# Altium schematic sheet CONNECTORS.SchDoc
size A3; SheetNumber: 4; SheetTotal: 7
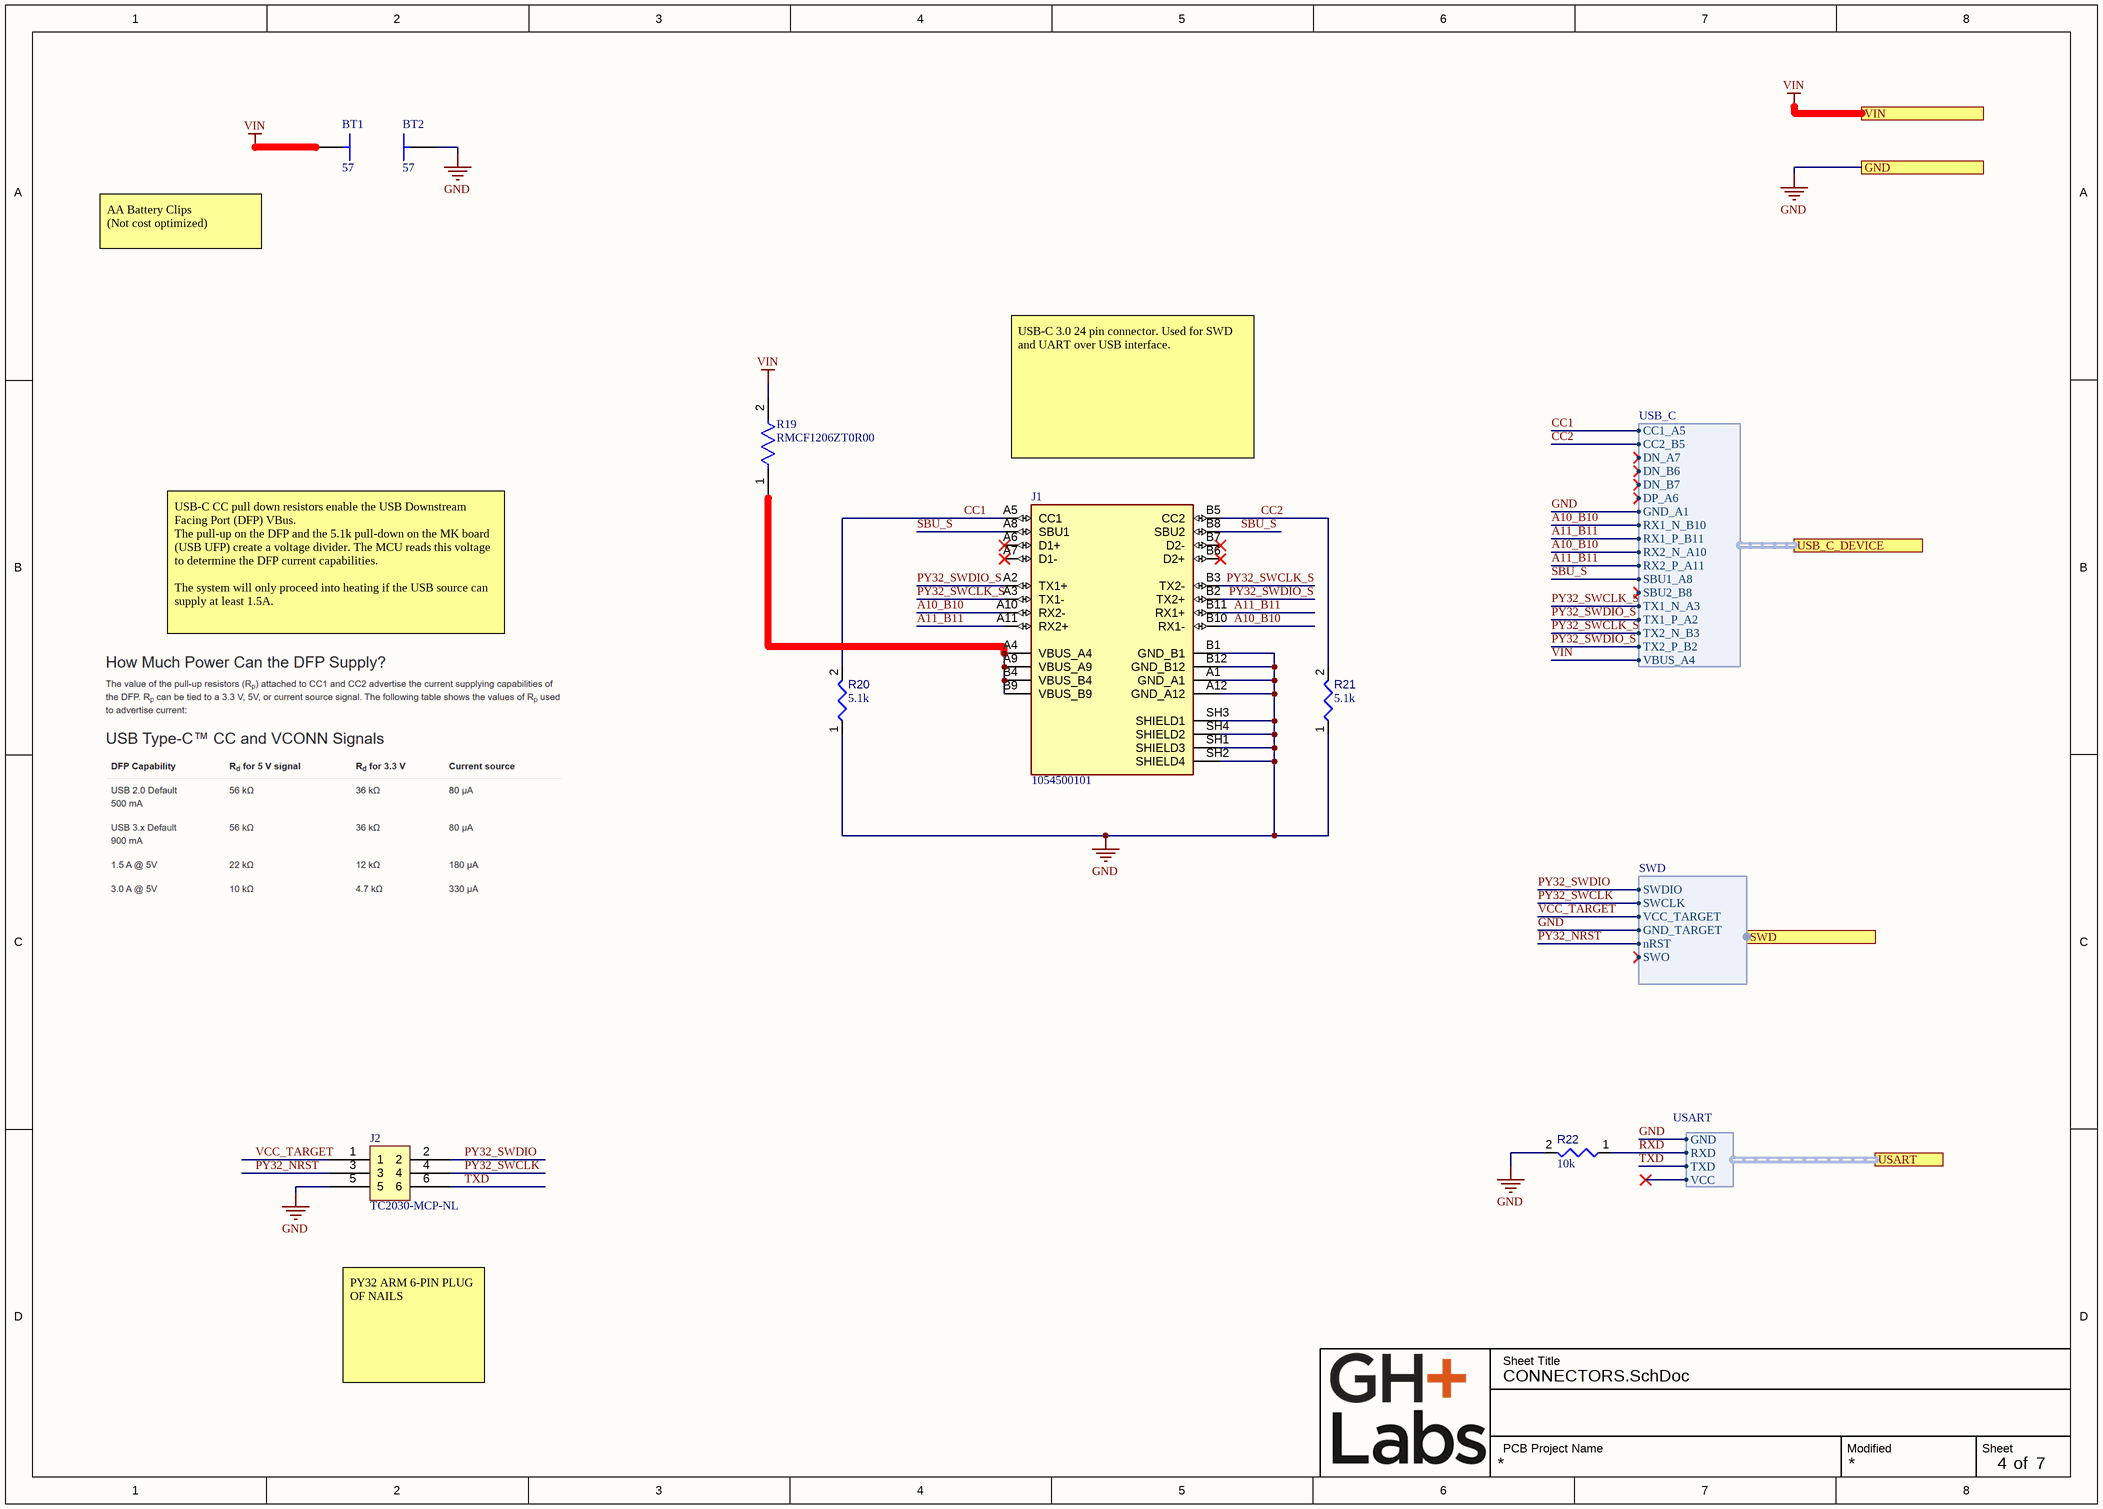
[diagram p0: CONNECTORS.SchDoc]

## Parts
BT1  57  [57-Footprint-1]
BT2  57  [57-Footprint-1]
J1  1054500101  [MOLEX_1054500101]
J2  TC2030-MCP-NL  [TC2030-MCP-NL]
R19  RMCF1206ZT0R00  [FP-RMCF1206-MFG]
R20  value 5.1k  [RESC0402(1005)_L]  (hidden comment: Resistor 5K1 +/-1 % 0402 63 mW)
R21  value 5.1k  [RESC0402(1005)_L]  (hidden comment: Resistor 5K1 +/-1 % 0402 63 mW)
R22  value 10k  [RESC0402(1005)_L]  (hidden comment: Resistor 10K  +/-1 % 0402 63 mW)

## Ports
GND, SWD (harness SWD), USART (harness USART), USB_C_DEVICE (harness USB_C), VIN

## Harnesses
USART: GND, RXD, TXD, VCC
USB_C: CC1_A5, CC2_B5, DN_A7, DN_B6, DN_B7, DP_A6, GND_A1, RX1_N_B10, RX1_P_B11, RX2_N_A10, RX2_P_A11, SBU1_A8, SBU2_B8, TX1_N_A3, TX1_P_A2, TX2_N_B3, TX2_P_B2, VBUS_A4
SWD: SWDIO, SWCLK, VCC_TARGET, GND_TARGET, nRST, SWO

## Nets
GND: BT2.P_1(POS) J1.A1(GND_A1) J1.A12(GND_A12) J1.B1(GND_B1) J1.B12(GND_B12) J1.SH1(SHIELD3) J1.SH2(SHIELD4) J1.SH3(SHIELD1) J1.SH4(SHIELD2) J2.5 R20.1 R21.1 R22.2 ; port GND, port USART.GND, port USB_C_DEVICE.GND_A1, port SWD.GND_TARGET
VIN: BT1.P_1(POS) R19.2 ; port VIN, port USB_C_DEVICE.VBUS_A4
A10_B10: J1.A10(RX2-) J1.B10(RX1-) ; port USB_C_DEVICE.RX1_N_B10, port USB_C_DEVICE.RX2_N_A10
A11_B11: J1.A11(RX2+) J1.B11(RX1+) ; port USB_C_DEVICE.RX1_P_B11, port USB_C_DEVICE.RX2_P_A11
CC1: J1.A5(CC1) R20.2 ; port USB_C_DEVICE.CC1_A5
CC2: J1.B5(CC2) R21.2 ; port USB_C_DEVICE.CC2_B5
PY32_NRST: J2.3 ; port SWD.nRST
PY32_SWCLK: J2.4 ; port SWD.SWCLK
PY32_SWCLK_S: J1.A3(TX1-) J1.B3(TX2-) ; port USB_C_DEVICE.TX1_N_A3, port USB_C_DEVICE.TX2_N_B3
PY32_SWDIO: J2.2 ; port SWD.SWDIO
PY32_SWDIO_S: J1.A2(TX1+) J1.B2(TX2+) ; port USB_C_DEVICE.TX1_P_A2, port USB_C_DEVICE.TX2_P_B2
RXD: R22.1 ; port USART.RXD
SBU_S: J1.A8(SBU1) J1.B8(SBU2) ; port USB_C_DEVICE.SBU1_A8
TXD: J2.6 ; port USART.TXD
VCC_TARGET: J2.1 ; port SWD.VCC_TARGET
NetJ1_A4: J1.A4(VBUS_A4) J1.A9(VBUS_A9) J1.B4(VBUS_B4) J1.B9(VBUS_B9) R19.1

Not connected (* = marked no-connect by the designer): J1 A6(D1+)* A7(D1-)* B6(D2+)* B7(D2-)*

## Notes on the sheet
- AA Battery Clips
  (Not cost optimized)
- USB-C 3.0 24 pin connector. Used for SWD and UART over USB interface.
- USB-C CC pull down resistors enable the USB Downstream Facing Port (DFP) VBus.
  The pull-up on the DFP and the 5.1k pull-down on the MK board (USB UFP) create a voltage divider. The MCU reads this voltage to determine the DFP current capabilities.
  The system will only proceed into heating if the USB source can supply at least 1.5A.
- PY32 ARM 6-PIN PLUG OF NAILS
- Sheet Title
- PCB Project Name
- Modified
- Sheet
- of

## Library data of the parts
BT1 BT2 = CMP-002-00078-5: A /AA SMT BATTERY CONTACT; MF: Keystone Electronics; Value: *; Design Item ID: 57; Case/Package: None; Component Type: Standard; MP: 57; Pins: 2; Check_prices: https://www.snapeda.com/parts/57/Keystone/view-part/?ref=eda; Source: 57.SchLib; SnapEDA_Link: https://www.snapeda.com/parts/57/Keystone/view-part/?ref=snap
J1 = CMP-002-00075-3: USB-C (USB TYPE-C) USB 3.2 Gen 2 (USB 3.1 Gen 2, Superspeed + (USB 3.1)) Receptacle Connector 24 Position Surface Mount, Right Angle; Through Hole; MF: Molex; Component Type: Standard; SnapEDA_Link: https://www.snapeda.com/parts/1054500101/Molex/view-part/?ref=snap; Pins: 28; Check_prices: https://www.snapeda.com/parts/1054500101/Molex/view-part/?ref=eda; Design Item ID: 1054500101; MP: 1054500101; Source: 1054500101.SchLib; Case/Package: None; Value: *
J2 = TC2030-MCP-NL: TAG CONNECT FOR UPDI
R19 = CMP-26527-005649-1: 0Ω ±0 0.25W 1206 Thick Film Chip Resistor AEC-Q200 compliant; Working Voltage: 200V; Power Rating: 250mW; Current Rating: 2A; Resistance: 0R; Construction: Rectangular; RoHS Compliant: Yes; Military Standard: Not; Radiation Hardening: No; Case/Package: 1206; Case Code (Imperial): 1206; Packaging: Tape and Reel; Resistor Type: Thick Film; Mount: Surface Mount; Lead Free: Lead Free; Case Code (Metric): 3216; Width: 0.063inch; Series: RMCF; Features: Automotive AEC-Q200; Number of Terminations: 2; Min Operating Temperature: -55°C; Max Power Dissipation: 250mW; Contact Plating: Tin; Length: 0.126inch; Height: 0.028inch; Technology: THICK FILM; Max Operating Temperature: 155°C; Depth: 1.6mm
R20 R21 = CMP-009-00177-1: Chip Resistor, 5.1 kOhms, +/-1 %, 63 mW, -55 to 155 degC, 0402; Power: 63mW; Tolerance: 1%; Case/Package: 0402; Pins: 2; RoHS Compliant: Yes; Max Operating Temperature: 155°C; Min Operating Temperature: -55°C; Mounting Technology: Surface Mount
R22 = CMP-009-00149-2: Chip Resistor, 10 kOhms, +/-1 %, 63 mW, -55 to 125 degC, 0402; Power: 63mW; Tolerance: 1%; Pins: 2; Max Operating Temperature: 155°C; Min Operating Temperature: -55°C; Case/Package: 0402